# Altium schematic sheet Sheet1.SchDoc
size 420 x 297 mm; Scale: 1:1; Обозначение документа: НГТУ.436229.007 Э3; Номер листа: 2
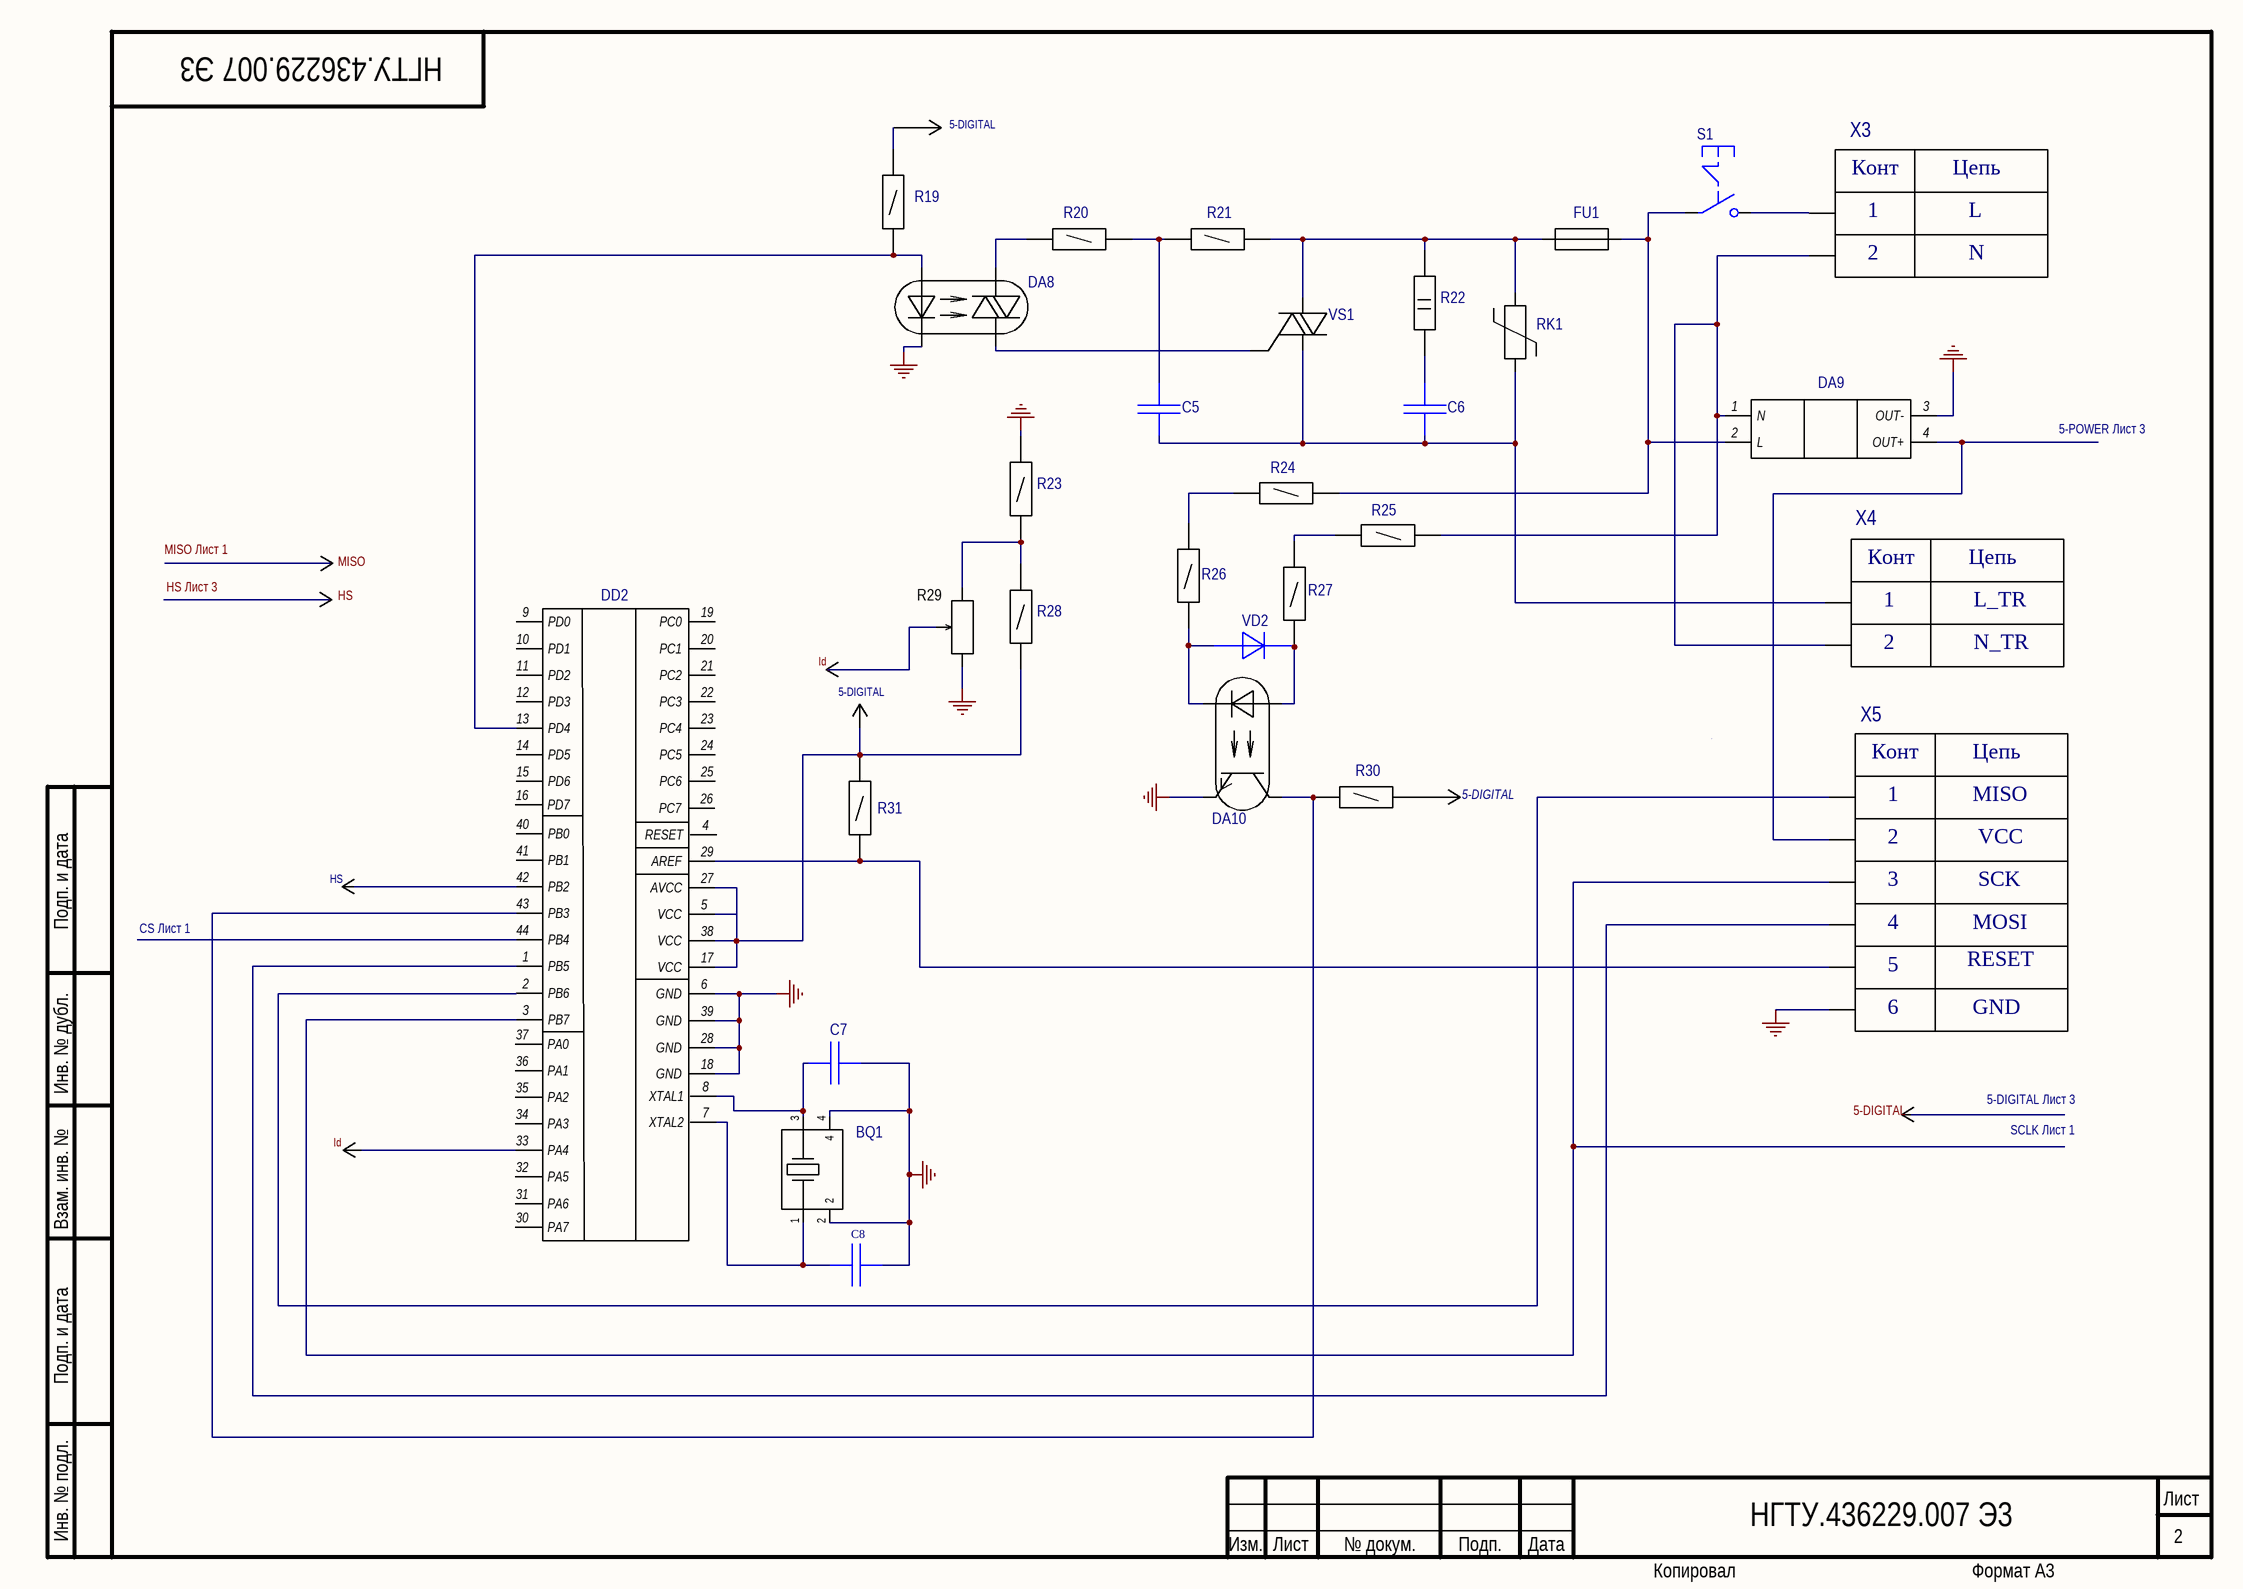
[diagram p0: Sheet1.SchDoc]

## Parts
BQ1  KX-7T  [KX-7 - duplicate]  (value not drawn)
C5  CAP  [cap_snubber_1kv_0.01uF]  (value not drawn)
C6  CAP  [cap_snubber_1kv_0.01uF]  (value not drawn)
C7  CAP  [CAP SMD 1206]  (value not drawn)
C8  CAP  [CAP SMD 1206]  (value not drawn)
DA8  MOC3050  [DIP-6]  (value not drawn)
DA9  IRM-5-05  [IRM20-5 (AC-DC)]  (value not drawn)
DA10  PC817  [DIP4]  (value not drawn)
DD2  aTMEGA16  [ATMEGA16]  (value not drawn)
FU1  (no value)  [FUSE-2]
R19  resistor  [Resistor SMD 1206]  (value not drawn)
R20  resistor  [Resistor SMD 1206]  (value not drawn)
R21  resistor  [Resistor SMD 1206]  (value not drawn)
R22  resistor  [RES_1W_HOR]  (value not drawn)
R23  resistor  [Resistor SMD 1206]  (value not drawn)
R24  resistor  [Resistor SMD 1206]  (value not drawn)
R25  resistor  [Resistor SMD 1206]  (value not drawn)
R26  resistor  [Resistor SMD 1206]  (value not drawn)
R27  resistor  [Resistor SMD 1206]  (value not drawn)
R28  resistor  [Resistor SMD 1206]  (value not drawn)
R29  R_3  [resperemen]  (value not drawn)
R30  resistor  [Resistor SMD 1206]  (value not drawn)
R31  resistor  [Resistor SMD 1206]  (value not drawn)
RK1  Varistor  [VAR_P_10]  (value not drawn)
S1  S_5_2  (value not drawn)
VD2  DIOD  [DO-214]  (value not drawn)
VS1  BTA06-800C  [TO-220AB]  (value not drawn)
X3  Connector_in  [PC250-836_90 deg]  (value not drawn)
X4  connector_out  [PC250-836_90 deg - duplicate]  (value not drawn)
X5  IDC-6MC  [IDC-6MS]  (value not drawn)

## Nets
GND: BQ1.2 BQ1.4 C7.2 C8.2 DA8.2 DA9.3(OUT-) DA10.3 DD2.6(GND) DD2.18(GND) DD2.28(GND) DD2.39(GND) R23.2 R29.1 X5.6
Id: R29.3
NetBQ1_1: BQ1.1(X1) C8.1 DD2.7(XTAL2)
NetBQ1_3: BQ1.3(X2) C7.1 DD2.8(XTAL1)
NetC5_1: C5.1 C6.1 RK1.2 VS1.1 X4.1
NetC5_2: C5.2 R20.2 R21.1
NetC6_2: C6.2 R22.1
NetDA8_1: DA8.1 DD2.13(PD4) R19.1
NetDA8_4: DA8.4 VS1.3
NetDA8_6: DA8.6 R20.1
NetDA9_1: DA9.1(N) R25.1 X3.2 X4.2
NetDA9_2: DA9.2(L) FU1.2 R24.2 S1.1
NetDA9_4: DA9.4(OUT+) X5.2
NetDA10_1: DA10.1 R27.1 VD2.2(К)
NetDA10_2: DA10.2 R26.1 VD2.1(А)
NetDA10_4: DA10.4 DD2.43(PB3) R30.1
NetDD2_1: DD2.1(PB5) X5.4
NetDD2_2: DD2.2(PB6) X5.1
NetDD2_3: DD2.3(PB7) X5.3
NetDD2_5: DD2.5(VCC) DD2.17(VCC) DD2.27(AVCC) DD2.38(VCC) R28.1 R31.2
NetDD2_29: DD2.29(AREF) R31.1 X5.5
NetFU1_1: FU1.1 R21.2 R22.2 RK1.1 VS1.2
NetR23_1: R23.1 R28.2 R29.2
NetR24_1: R24.1 R26.2
NetR25_2: R25.2 R27.2
NetS1_2: S1.2 X3.1

Not connected (* = marked no-connect by the designer): DA8 A C; DD2 4(RESET) 9(PD0) 10(PD1) 11(PD2) 12(PD3) 14(PD5) 15(PD6) 16(PD7) 19(PC0) 20(PC1) 21(PC2) 22(PC3) 23(PC4) 24(PC5) 25(PC6) 26(PC7) 30(PA7) 31(PA6) 32(PA5) 33(PA4) 34(PA3) 35(PA2) 36(PA1) 37(PA0) 40(PB0) 41(PB1) 42(PB2) 44(PB4); R19 2; R30 2

## Notes on the sheet
- 5-DIGITAL
- 5-POWER Лист 3
- CS Лист 1
- HS
- 5-DIGITAL Лист 3
- SCLK Лист 1 < >
- Labels drawn without touching a wire or pin: 5-DIGITAL, HS, HS Лист 3, Id, MISO, MISO Лист 1
- Подп. и дата
- Инв. № дубл.
- Взам. инв. №
- Инв. № подл.
- Изм.
- Лист
- № докум.
- Подп.
- Дата
- Копировал
- Формат А3
- (in symbol Connector_in) Конт; Цепь; L; N
- (in symbol connector_out) Конт; Цепь; L_TR; N_TR
- (in symbol IDC-6MC) Конт; Цепь; MISO; VCC; SCK; MOSI; RESET; GND

## Library data of the parts
DA9 = IRM-5-05_1
DD2 = aTMEGA16_32 PIN
FU1 = Fuse
R22 = 2W RES
VS1 = triac